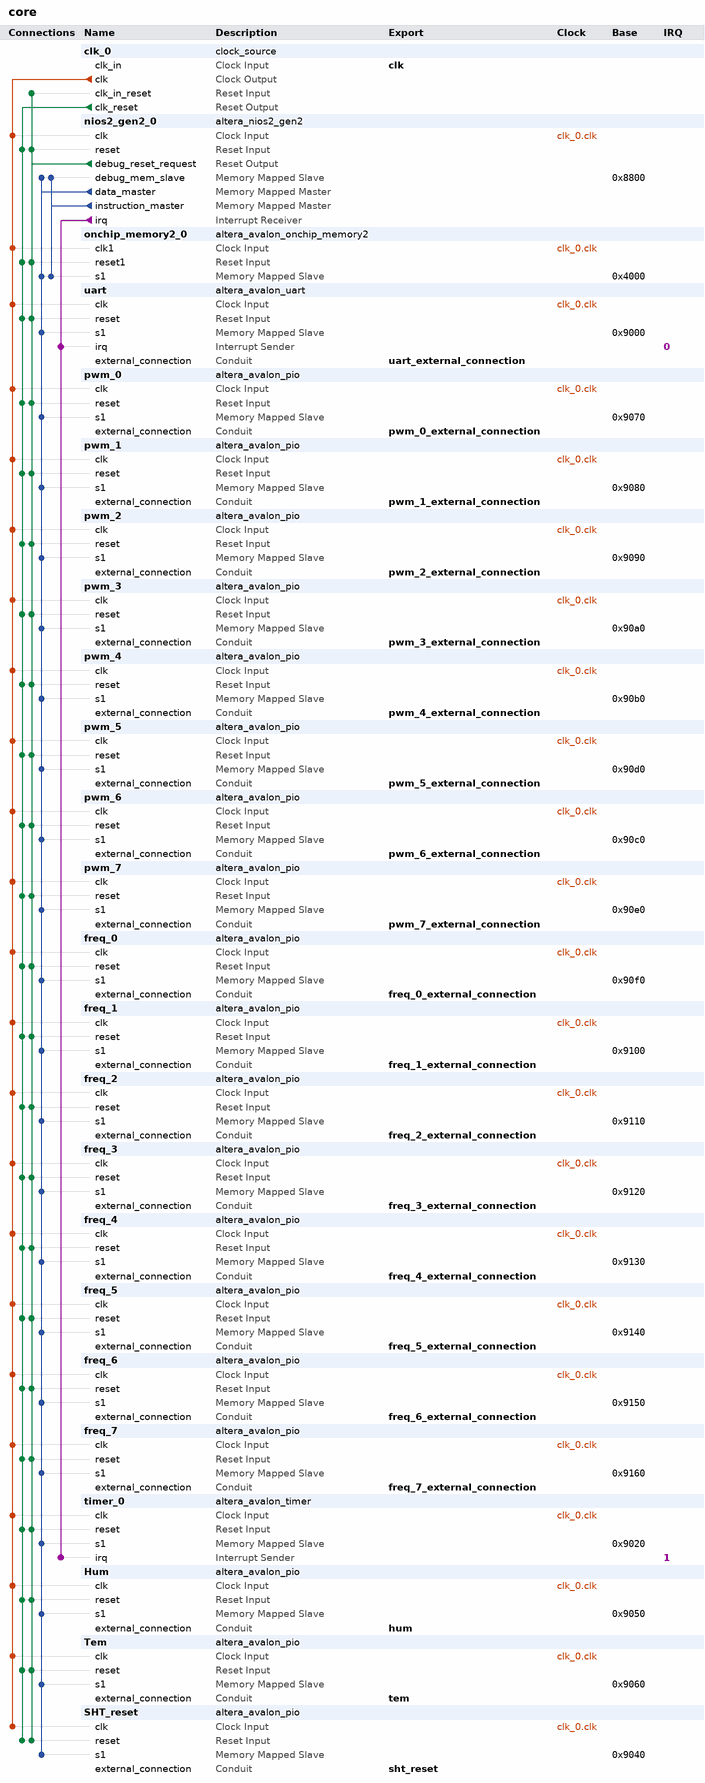
[diagram p0: system contents]
# Platform Designer (Qsys) system core, Cyclone V 5CSEMA5F31C6
# Parameters at their usual value, and those the tool derives, are not listed.
package require -exact qsys 16.1
create_system core
set_project_property DEVICE_FAMILY {Cyclone V}
set_project_property DEVICE 5CSEMA5F31C6

add_instance clk_0 clock_source 16.1
set_instance_parameter_value clk_0 clockFrequency 50000000

add_instance nios2_gen2_0 altera_nios2_gen2 16.1
set_instance_parameter_value nios2_gen2_0 dcache_size 2048
set_instance_parameter_value nios2_gen2_0 exceptionSlave onchip_memory2_0.s1
set_instance_parameter_value nios2_gen2_0 icache_size 4096
set_instance_parameter_value nios2_gen2_0 impl Tiny
set_instance_parameter_value nios2_gen2_0 resetSlave onchip_memory2_0.s1

add_instance onchip_memory2_0 altera_avalon_onchip_memory2 16.1
set_instance_parameter_value onchip_memory2_0 dataWidth 32
set_instance_parameter_value onchip_memory2_0 dualPort false
set_instance_parameter_value onchip_memory2_0 initMemContent true
set_instance_parameter_value onchip_memory2_0 initializationFileName onchip_mem.hex
set_instance_parameter_value onchip_memory2_0 memorySize 16384

add_instance uart altera_avalon_uart 16.1
set_instance_parameter_value uart baud 115200
set_instance_parameter_value uart dataBits 8
set_instance_parameter_value uart fixedBaud true
set_instance_parameter_value uart parity NONE
set_instance_parameter_value uart stopBits 1

add_instance pwm_0 altera_avalon_pio 16.1
set_instance_parameter_value pwm_0 direction Output
set_instance_parameter_value pwm_0 width 7

add_instance pwm_1 altera_avalon_pio 16.1
set_instance_parameter_value pwm_1 direction Output
set_instance_parameter_value pwm_1 width 7

add_instance pwm_2 altera_avalon_pio 16.1
set_instance_parameter_value pwm_2 direction Output
set_instance_parameter_value pwm_2 width 7

add_instance pwm_3 altera_avalon_pio 16.1
set_instance_parameter_value pwm_3 direction Output
set_instance_parameter_value pwm_3 width 7

add_instance pwm_4 altera_avalon_pio 16.1
set_instance_parameter_value pwm_4 direction Output
set_instance_parameter_value pwm_4 width 7

add_instance pwm_5 altera_avalon_pio 16.1
set_instance_parameter_value pwm_5 direction Output
set_instance_parameter_value pwm_5 width 7

add_instance pwm_6 altera_avalon_pio 16.1
set_instance_parameter_value pwm_6 direction Output
set_instance_parameter_value pwm_6 width 7

add_instance pwm_7 altera_avalon_pio 16.1
set_instance_parameter_value pwm_7 direction Output
set_instance_parameter_value pwm_7 width 7

add_instance freq_0 altera_avalon_pio 16.1
set_instance_parameter_value freq_0 direction Input
set_instance_parameter_value freq_0 width 24

add_instance freq_1 altera_avalon_pio 16.1
set_instance_parameter_value freq_1 direction Input
set_instance_parameter_value freq_1 width 24

add_instance freq_2 altera_avalon_pio 16.1
set_instance_parameter_value freq_2 direction Input
set_instance_parameter_value freq_2 width 24

add_instance freq_3 altera_avalon_pio 16.1
set_instance_parameter_value freq_3 direction Input
set_instance_parameter_value freq_3 width 24

add_instance freq_4 altera_avalon_pio 16.1
set_instance_parameter_value freq_4 direction Input
set_instance_parameter_value freq_4 width 24

add_instance freq_5 altera_avalon_pio 16.1
set_instance_parameter_value freq_5 direction Input
set_instance_parameter_value freq_5 width 24

add_instance freq_6 altera_avalon_pio 16.1
set_instance_parameter_value freq_6 direction Input
set_instance_parameter_value freq_6 width 24

add_instance freq_7 altera_avalon_pio 16.1
set_instance_parameter_value freq_7 direction Input
set_instance_parameter_value freq_7 width 24

add_instance timer_0 altera_avalon_timer 16.1
set_instance_parameter_value timer_0 period 1
set_instance_parameter_value timer_0 periodUnits SEC

add_instance Hum altera_avalon_pio 16.1
set_instance_parameter_value Hum direction Input
set_instance_parameter_value Hum width 16

add_instance Tem altera_avalon_pio 16.1
set_instance_parameter_value Tem direction Input
set_instance_parameter_value Tem width 16

add_instance SHT_reset altera_avalon_pio 16.1
set_instance_parameter_value SHT_reset direction Output
set_instance_parameter_value SHT_reset width 1

# connections
add_connection clk_0.clk freq_0.clk clock
add_connection clk_0.clk freq_1.clk clock
add_connection clk_0.clk freq_2.clk clock
add_connection clk_0.clk freq_3.clk clock
add_connection clk_0.clk freq_4.clk clock
add_connection clk_0.clk freq_5.clk clock
add_connection clk_0.clk freq_6.clk clock
add_connection clk_0.clk freq_7.clk clock
add_connection clk_0.clk Hum.clk clock
add_connection clk_0.clk nios2_gen2_0.clk clock
add_connection clk_0.clk onchip_memory2_0.clk1 clock
add_connection clk_0.clk pwm_0.clk clock
add_connection clk_0.clk pwm_1.clk clock
add_connection clk_0.clk pwm_2.clk clock
add_connection clk_0.clk pwm_3.clk clock
add_connection clk_0.clk pwm_4.clk clock
add_connection clk_0.clk pwm_5.clk clock
add_connection clk_0.clk pwm_6.clk clock
add_connection clk_0.clk pwm_7.clk clock
add_connection clk_0.clk SHT_reset.clk clock
add_connection clk_0.clk Tem.clk clock
add_connection clk_0.clk timer_0.clk clock
add_connection clk_0.clk uart.clk clock
add_connection clk_0.clk_reset freq_0.reset reset
add_connection clk_0.clk_reset freq_1.reset reset
add_connection clk_0.clk_reset freq_2.reset reset
add_connection clk_0.clk_reset freq_3.reset reset
add_connection clk_0.clk_reset freq_4.reset reset
add_connection clk_0.clk_reset freq_5.reset reset
add_connection clk_0.clk_reset freq_6.reset reset
add_connection clk_0.clk_reset freq_7.reset reset
add_connection clk_0.clk_reset Hum.reset reset
add_connection clk_0.clk_reset nios2_gen2_0.reset reset
add_connection clk_0.clk_reset onchip_memory2_0.reset1 reset
add_connection clk_0.clk_reset pwm_0.reset reset
add_connection clk_0.clk_reset pwm_1.reset reset
add_connection clk_0.clk_reset pwm_2.reset reset
add_connection clk_0.clk_reset pwm_3.reset reset
add_connection clk_0.clk_reset pwm_4.reset reset
add_connection clk_0.clk_reset pwm_5.reset reset
add_connection clk_0.clk_reset pwm_6.reset reset
add_connection clk_0.clk_reset pwm_7.reset reset
add_connection clk_0.clk_reset SHT_reset.reset reset
add_connection clk_0.clk_reset Tem.reset reset
add_connection clk_0.clk_reset timer_0.reset reset
add_connection clk_0.clk_reset uart.reset reset
add_connection nios2_gen2_0.debug_reset_request clk_0.clk_in_reset reset
add_connection nios2_gen2_0.debug_reset_request freq_0.reset reset
add_connection nios2_gen2_0.debug_reset_request freq_1.reset reset
add_connection nios2_gen2_0.debug_reset_request freq_2.reset reset
add_connection nios2_gen2_0.debug_reset_request freq_3.reset reset
add_connection nios2_gen2_0.debug_reset_request freq_4.reset reset
add_connection nios2_gen2_0.debug_reset_request freq_5.reset reset
add_connection nios2_gen2_0.debug_reset_request freq_6.reset reset
add_connection nios2_gen2_0.debug_reset_request freq_7.reset reset
add_connection nios2_gen2_0.debug_reset_request Hum.reset reset
add_connection nios2_gen2_0.debug_reset_request nios2_gen2_0.reset reset
add_connection nios2_gen2_0.debug_reset_request onchip_memory2_0.reset1 reset
add_connection nios2_gen2_0.debug_reset_request pwm_0.reset reset
add_connection nios2_gen2_0.debug_reset_request pwm_1.reset reset
add_connection nios2_gen2_0.debug_reset_request pwm_2.reset reset
add_connection nios2_gen2_0.debug_reset_request pwm_3.reset reset
add_connection nios2_gen2_0.debug_reset_request pwm_4.reset reset
add_connection nios2_gen2_0.debug_reset_request pwm_5.reset reset
add_connection nios2_gen2_0.debug_reset_request pwm_6.reset reset
add_connection nios2_gen2_0.debug_reset_request pwm_7.reset reset
add_connection nios2_gen2_0.debug_reset_request SHT_reset.reset reset
add_connection nios2_gen2_0.debug_reset_request Tem.reset reset
add_connection nios2_gen2_0.debug_reset_request timer_0.reset reset
add_connection nios2_gen2_0.debug_reset_request uart.reset reset
add_connection nios2_gen2_0.data_master freq_0.s1 avalon
set_connection_parameter_value nios2_gen2_0.data_master/freq_0.s1 baseAddress 0x90f0
add_connection nios2_gen2_0.data_master freq_1.s1 avalon
set_connection_parameter_value nios2_gen2_0.data_master/freq_1.s1 baseAddress 0x9100
add_connection nios2_gen2_0.data_master freq_2.s1 avalon
set_connection_parameter_value nios2_gen2_0.data_master/freq_2.s1 baseAddress 0x9110
add_connection nios2_gen2_0.data_master freq_3.s1 avalon
set_connection_parameter_value nios2_gen2_0.data_master/freq_3.s1 baseAddress 0x9120
add_connection nios2_gen2_0.data_master freq_4.s1 avalon
set_connection_parameter_value nios2_gen2_0.data_master/freq_4.s1 baseAddress 0x9130
add_connection nios2_gen2_0.data_master freq_5.s1 avalon
set_connection_parameter_value nios2_gen2_0.data_master/freq_5.s1 baseAddress 0x9140
add_connection nios2_gen2_0.data_master freq_6.s1 avalon
set_connection_parameter_value nios2_gen2_0.data_master/freq_6.s1 baseAddress 0x9150
add_connection nios2_gen2_0.data_master freq_7.s1 avalon
set_connection_parameter_value nios2_gen2_0.data_master/freq_7.s1 baseAddress 0x9160
add_connection nios2_gen2_0.data_master Hum.s1 avalon
set_connection_parameter_value nios2_gen2_0.data_master/Hum.s1 baseAddress 0x9050
add_connection nios2_gen2_0.data_master nios2_gen2_0.debug_mem_slave avalon
set_connection_parameter_value nios2_gen2_0.data_master/nios2_gen2_0.debug_mem_slave baseAddress 0x8800
add_connection nios2_gen2_0.data_master onchip_memory2_0.s1 avalon
set_connection_parameter_value nios2_gen2_0.data_master/onchip_memory2_0.s1 baseAddress 0x4000
add_connection nios2_gen2_0.data_master pwm_0.s1 avalon
set_connection_parameter_value nios2_gen2_0.data_master/pwm_0.s1 baseAddress 0x9070
add_connection nios2_gen2_0.data_master pwm_1.s1 avalon
set_connection_parameter_value nios2_gen2_0.data_master/pwm_1.s1 baseAddress 0x9080
add_connection nios2_gen2_0.data_master pwm_2.s1 avalon
set_connection_parameter_value nios2_gen2_0.data_master/pwm_2.s1 baseAddress 0x9090
add_connection nios2_gen2_0.data_master pwm_3.s1 avalon
set_connection_parameter_value nios2_gen2_0.data_master/pwm_3.s1 baseAddress 0x90a0
add_connection nios2_gen2_0.data_master pwm_4.s1 avalon
set_connection_parameter_value nios2_gen2_0.data_master/pwm_4.s1 baseAddress 0x90b0
add_connection nios2_gen2_0.data_master pwm_5.s1 avalon
set_connection_parameter_value nios2_gen2_0.data_master/pwm_5.s1 baseAddress 0x90d0
add_connection nios2_gen2_0.data_master pwm_6.s1 avalon
set_connection_parameter_value nios2_gen2_0.data_master/pwm_6.s1 baseAddress 0x90c0
add_connection nios2_gen2_0.data_master pwm_7.s1 avalon
set_connection_parameter_value nios2_gen2_0.data_master/pwm_7.s1 baseAddress 0x90e0
add_connection nios2_gen2_0.data_master SHT_reset.s1 avalon
set_connection_parameter_value nios2_gen2_0.data_master/SHT_reset.s1 baseAddress 0x9040
add_connection nios2_gen2_0.data_master Tem.s1 avalon
set_connection_parameter_value nios2_gen2_0.data_master/Tem.s1 baseAddress 0x9060
add_connection nios2_gen2_0.data_master timer_0.s1 avalon
set_connection_parameter_value nios2_gen2_0.data_master/timer_0.s1 baseAddress 0x9020
add_connection nios2_gen2_0.data_master uart.s1 avalon
set_connection_parameter_value nios2_gen2_0.data_master/uart.s1 baseAddress 0x9000
add_connection nios2_gen2_0.instruction_master nios2_gen2_0.debug_mem_slave avalon
set_connection_parameter_value nios2_gen2_0.instruction_master/nios2_gen2_0.debug_mem_slave baseAddress 0x8800
add_connection nios2_gen2_0.instruction_master onchip_memory2_0.s1 avalon
set_connection_parameter_value nios2_gen2_0.instruction_master/onchip_memory2_0.s1 baseAddress 0x4000
add_connection nios2_gen2_0.irq timer_0.irq interrupt
set_connection_parameter_value nios2_gen2_0.irq/timer_0.irq irqNumber 1
add_connection nios2_gen2_0.irq uart.irq interrupt
set_connection_parameter_value nios2_gen2_0.irq/uart.irq irqNumber 0

# exported interfaces
add_interface clk clock sink
set_interface_property clk EXPORT_OF clk_0.clk_in
add_interface freq_0_external_connection conduit end
set_interface_property freq_0_external_connection EXPORT_OF freq_0.external_connection
add_interface freq_1_external_connection conduit end
set_interface_property freq_1_external_connection EXPORT_OF freq_1.external_connection
add_interface freq_2_external_connection conduit end
set_interface_property freq_2_external_connection EXPORT_OF freq_2.external_connection
add_interface freq_3_external_connection conduit end
set_interface_property freq_3_external_connection EXPORT_OF freq_3.external_connection
add_interface freq_4_external_connection conduit end
set_interface_property freq_4_external_connection EXPORT_OF freq_4.external_connection
add_interface freq_5_external_connection conduit end
set_interface_property freq_5_external_connection EXPORT_OF freq_5.external_connection
add_interface freq_6_external_connection conduit end
set_interface_property freq_6_external_connection EXPORT_OF freq_6.external_connection
add_interface freq_7_external_connection conduit end
set_interface_property freq_7_external_connection EXPORT_OF freq_7.external_connection
add_interface hum conduit end
set_interface_property hum EXPORT_OF Hum.external_connection
add_interface pwm_0_external_connection conduit end
set_interface_property pwm_0_external_connection EXPORT_OF pwm_0.external_connection
add_interface pwm_1_external_connection conduit end
set_interface_property pwm_1_external_connection EXPORT_OF pwm_1.external_connection
add_interface pwm_2_external_connection conduit end
set_interface_property pwm_2_external_connection EXPORT_OF pwm_2.external_connection
add_interface pwm_3_external_connection conduit end
set_interface_property pwm_3_external_connection EXPORT_OF pwm_3.external_connection
add_interface pwm_4_external_connection conduit end
set_interface_property pwm_4_external_connection EXPORT_OF pwm_4.external_connection
add_interface pwm_5_external_connection conduit end
set_interface_property pwm_5_external_connection EXPORT_OF pwm_5.external_connection
add_interface pwm_6_external_connection conduit end
set_interface_property pwm_6_external_connection EXPORT_OF pwm_6.external_connection
add_interface pwm_7_external_connection conduit end
set_interface_property pwm_7_external_connection EXPORT_OF pwm_7.external_connection
add_interface sht_reset conduit end
set_interface_property sht_reset EXPORT_OF SHT_reset.external_connection
add_interface tem conduit end
set_interface_property tem EXPORT_OF Tem.external_connection
add_interface uart_external_connection conduit end
set_interface_property uart_external_connection EXPORT_OF uart.external_connection

set_interconnect_requirement {$system} qsys_mm.clockCrossingAdapter HANDSHAKE
set_interconnect_requirement {$system} qsys_mm.enableEccProtection FALSE
set_interconnect_requirement {$system} qsys_mm.insertDefaultSlave FALSE
set_interconnect_requirement {$system} qsys_mm.maxAdditionalLatency 1

save_system core.qsys
